# Altium schematic sheet 00_power.SchDoc
size A4; SheetNumber: 1; SheetTotal: 4
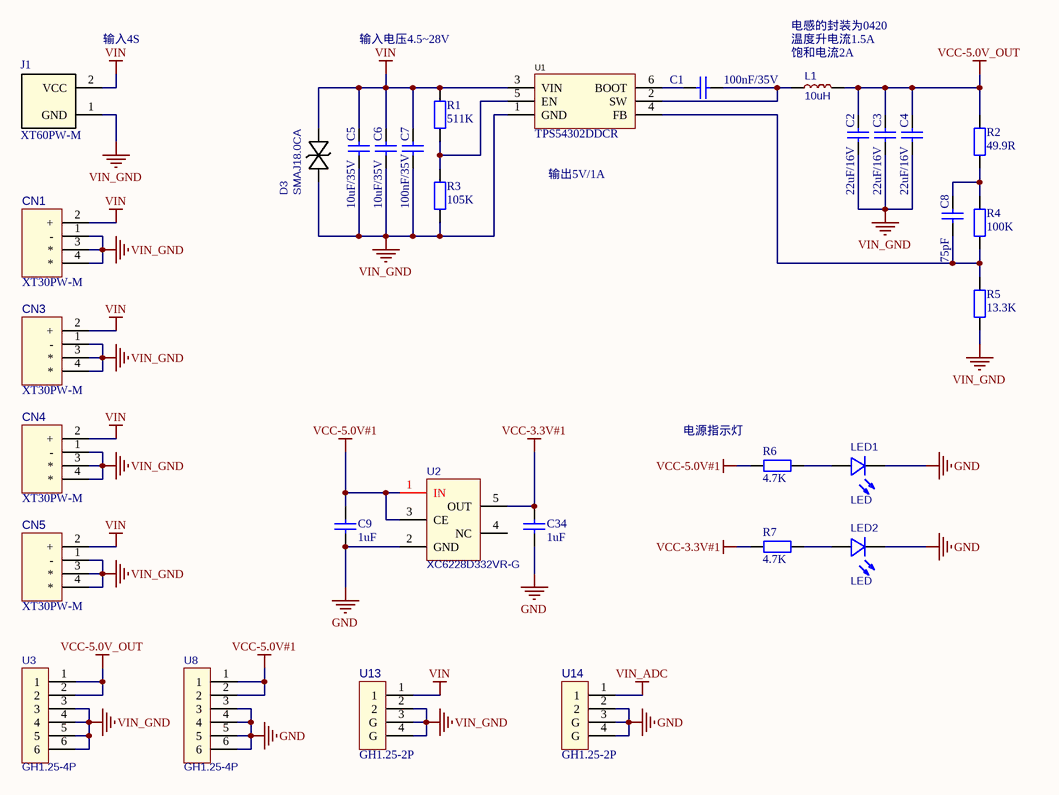
[diagram p0: 00_power.SchDoc]

## Parts
C1  100nF/35V  [0603-C]
C2  22uF/16V  [1206-C]
C3  22uF/16V  [1206-C]
C4  22uF/16V  [1206-C]
C5  10uF/35V  [0805-C]
C6  10uF/35V  [0805-C]
C7  100nF/35V  [0805-C]
C8  75pF  [0603-C]
C9  1uF  [0603-C]
C34  1uF  [0603-C]
CN1  XT30PW-M  [XT30PW-M]
CN3  XT30PW-M  [XT30PW-M]
CN4  XT30PW-M  [XT30PW-M]
CN5  XT30PW-M  [XT30PW-M]
D3  SMAJ18.0CA  [ZENER]
J1  XT60PW-M  [XT60PW-M]
L1  10uH  [电感 4.2X4.4]
LED1  LED  [LED-0603]
LED2  LED  [LED-0603]
R1  511K  [0603-R]
R2  49.9R  [0603-R]
R3  105K  [0603-R]
R4  100K  [0603-R]
R5  13.3K  [0603-R]
R6  4.7K  [0603-R]
R7  4.7K  [0603-R]
U1  TPS54302DDCR  [TPS54302]
U2  XC6228D332VR-G  [XC6228D332VR-G]
U3  GH1.25-4P  [CONN-SMD_GH1.25-4PWBPZ]
U8  GH1.25-4P  [CONN-SMD_GH1.25-4PWBPZ]
U13  GH1.25-2P  [GH1.25-2P]
U14  GH1.25-2P  [GH1.25-2P]

## Nets
GND: C9.1 C34.1 LED1.1(-) LED2.1(-) U2.2(GND) U8.3 U8.4 U8.5 U8.6 U14.2 U14.3(G) U14.4(G)
VCC-3.3V#1: C34.2 R7.1 U2.5(OUT)
VCC-5.0V#1: C9.2 R6.1 U2.1(IN) U2.3(CE) U8.1 U8.2
VCC-5.0V_OUT: C2.2 C3.2 C4.2 L1.2 R2.2 U3.1 U3.2
VIN: C5.2 C6.2 C7.2 CN1.2(+) CN3.2(+) CN4.2(+) CN5.2(+) D3.2(A) J1.2(VCC) R1.2 U1.3(VIN) U13.1
VIN_ADC: U14.1
VIN_GND: C2.1 C3.1 C4.1 C5.1 C6.1 C7.1 CN1.1(-) CN1.3 CN1.4 CN3.1(-) CN3.3 CN3.4 CN4.1(-) CN4.3 CN4.4 CN5.1(-) CN5.3 CN5.4 D3.1(C) J1.1(GND) R3.1 R5.1 U1.1(GND) U3.3 U3.4 U3.5 U3.6 U13.2 U13.3(G) U13.4(G)
NetC1_1: C1.1 U1.6(BOOT)
NetC1_2: C1.2 L1.1 U1.2(SW)
NetC8_1: C8.1 R4.1 R5.2 U1.4(FB)
NetC8_2: C8.2 R2.1 R4.2
NetLED1_2: LED1.2(+) R6.2
NetLED2_2: LED2.2(+) R7.2
NetR1_1: R1.1 R3.2 U1.5(EN)

Not connected (* = marked no-connect by the designer): U2 4(NC)

## Notes on the sheet
- (near J1) 输入4S
- 输入电压4.5~28V
- 电感的封装为0420
- (near L1) 温度升电流1.5A
- (near L1) 饱和电流2A
- 输出5V/1A
- 电源指示灯

## Library data of the parts
C1-C9 C34 = C: 贴片电容; BOM名称: 无极性贴片电容; 联系卖家，免费查找封装: 唯一出售店铺网址https://shop463601444.taobao.com
CN1 CN3-CN5 = XT30PW-M: Manufacturer: AMASS(艾迈斯); Add into BOM: yes; Brand: 艾迈斯; RatedVoltage: DC 500V; InterfaceType: 公头; RatedCurrent: 15A; RecommendedWireGauge: 16/18/20AWG; contact resistance: 1.2mΩ; specifications: 2pin; Symbol: XT30PW-M; Device: XT30PW-M; Supplier: LCSC; Supplier Part: C431092; Manufacturer Part: XT30PW-M; JLCPCB Part Class: Extended Part; LCSC Part Name: AMASS(艾迈斯)航模插头 卧式弯脚 XT30PW-M公头; Supplier Footprint: -; Datasheet: https://atta.szlcsc.com/upload/public/pdf/source/20220222/6A9F22F7850E25B33E1BE430ADF8560B.pdf; Convert to PCB: yes; Model: XT30PW-M; Power: -; Output: -; Input: -; Size: -; Interface: -; Type: 航模插头; Colour: -; MaximumCurrent: -; Type1: -; NumberOfUSBHoles: -; MetalMaterial: -; InsulationMaterial: -; FlameRetardantGrade: -; Belt length: -
D3 = SMAJ6.0CA: SMAJ6.0CA_C698928; BOM_Manufacturer: Yangzhou Yangjie Elec Tech; Contributor: LCSC; BOM_Supplier: LCSC; BOM_Supplier Part: C698928; BOM_Manufacturer Part: SMAJ6.0CA; BOM_JLCPCB Part Class: Extended Part; spicePre: D; spiceSymbolName: SMAJ6.0CA_C698928
J1 = XT60PW-M: PCB Power Connector; Manufacturer_Name: Amass; Manufacturer_Part_Number: XT60PW-F; Datasheet Link: https://www.tme.eu/sl/Document/ce4077e36b79046da520ca73227e15de/XT30PW%20SPEC.pdf; Height: 8.4mm
L1 = L: BOM_Manufacturer: Sunlord; BOM_Manufacturer Part: UPZ2012D800-4R0TF; nameAlias: Value; Contributor: LCSC; BOM_Supplier: LCSC; BOM_Supplier Part: C145060; BOM_JLCPCB Part Class: Extended Part; spicePre: L; spiceSymbolName: UPZ2012D800-4R0TF
LED1 LED2 = LED: BOM_Manufacturer: Wuxi ARK Tech Elec; BOM_Manufacturer Part: D-G060306G1-KS2; Contributor: LCSC; BOM_Supplier: LCSC; BOM_Supplier Part: C118334; BOM_JLCPCB Part Class: Extended Part; spicePre: L; spiceSymbolName: D-G060306G1-KS2
R1-R7 = R: 贴片电阻; 联系卖家，免费查找封装: 唯一出售店铺网址https://shop463601444.taobao.com; BOM名称: 贴片电阻
U1 = TPS54302DDCR: Manufacturer: TI(德州仪器); Symbol: TPS54302DDCR_C311983; Add into BOM: yes; Function: 降压型; Synchronous Rectification: 是; Output Type: 可调; Number of Outputs: 1; Topology: 降压式; Input Voltage: 4.5V~28V; Output Voltage: 596mV~28V; Output Current (Max): 3A; Switching Frequency: 400kHz; Device: TPS54302DDCR; LCSC Part Name: 降压型 输入4.5V~28V 输出596mV~28V 3A; Supplier Part: C311983; Manufacturer Part: TPS54302DDCR; Supplier Footprint: TSOT-23-6; JLCPCB Part Class: Extended Part; Datasheet: https://atta.szlcsc.com/upload/public/pdf/source/20181023/C311983_0948EE70BFAD2011B492BD3F4CEA709D.pdf; Supplier: LCSC; Convert to PCB: yes; Operating Temperature: -40℃~+125℃@(TJ)
U2 = XC6228D332VR-G: 输出类型：固定 输出极性：正 输出通道数：1 最大输入电压：5.5V 输出电压：3.3V 压差：305mV@(300mA) 输出电流：300mA 电源纹波抑制比(PSRR)：80dB@(1kHz) 3.3V固定输出，Iout=300mA，Vin=5.5V(Max); BOM_Manufacturer: TOREX; BOM_Supplier: LCSC; BOM_Manufacturer Part: XC6228D332VR-G; BOM_Supplier Part: C69841; BOM_JLCPCB Part Class: Extended Part; spicePre: U; spiceSymbolName: XC6228D332VR-G
U3 U8 = GH1.25-4P: GH1.25-4PWBPZ; BOM_Manufacturer: BOOMELE(博穆精密); Contributor: LCSC; BOM_Supplier: LCSC; BOM_Supplier Part: C2829253; BOM_Manufacturer Part: GH1.25-4PWBPZ; spicePre: U; spiceSymbolName: GH1.25-4PWBPZ
U13 U14 = GH1.25-2P: Manufacturer: Bossie(博锡); Symbol: BX-GH1.25-2PWT; Add into BOM: yes; Pins Structure: 1x2P; Pitch: 1.25mm; Reference Series: GH; Number of PINs Per Row: 2; Current Rating (Max): 1A; Device: BX-GH1.25-2PWT; Supplier: LCSC; Supplier Part: C18077718; Manufacturer Part: BX-GH1.25-2PWT; LCSC Part Name: BX-GH1.25-2PWT; Supplier Footprint: SMD,P=1.25mm,卧贴; Datasheet: https://atta.szlcsc.com/upload/public/pdf/source/20231017/25DD0A5C9398B9B8D9D2789B9E1BDAD3.pdf; Convert to PCB: yes; Mounting Style: 卧贴; Number of Pins: 2P; Number of Rows: 1; Row Spacing: -; Contact Material: 磷铜; Contact Plating: 锡; Operating Temperature Range: -25℃~+85℃